# EAGLE design start_board (EAGLE 9.6.2)
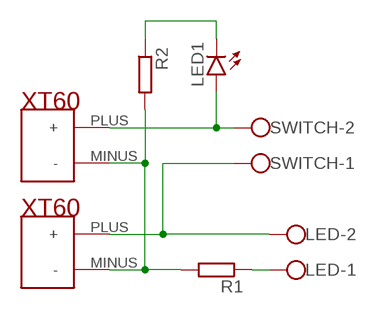
[diagram p0: schematic, sheet 1]

## Parts
LED  W237-102  [W237-102]
LED1  LEDCHIPLED_1206  [CHIPLED_1206]
R1  R-EU_M1206  [M1206]
R2  R-EU_M1206  [M1206]
SWITCH  W237-102  [W237-102]
U$1  XT60  [XT60_FOOTPRINT]
U$2  XT60  [XT60_FOOTPRINT]

## Nets
N$1: R1.2 R2.2 U$1.MINUS(-) U$2.MINUS(-)
N$2: LED1.A SWITCH.2 U$1.PLUS(+)
N$3: LED.2 SWITCH.1 U$2.PLUS(+)
N$4: LED1.C R2.1
N$5: LED.1 R1.1

## Library data of the parts
LED SWITCH = con-wago-500:W237-102: WAGO SCREW CLAMP; MPN: 237-102; OC_FARNELL: unknown; OC_NEWARK: 70K9898
LED1 = led:LED: LED OSRAM: - CHIPLED LG R971, LG N971, LY N971, LG Q971, LY Q971, LO R971, LY R971 LH N974, LH R974 LS Q976, LO Q976, LY Q976 LO Q996 - Hyper CHIPLED LW Q18S LB Q993, LB Q99A, LB R99A - SideLED LS A670, LO A670, LY A670, LG A670, LP A670 LB A673, LV A673, LT A673, LW A673 LH A674 LY A675 LS A676, LA A676, LO A676, LY A676, LW A676 LS A679, LY A679, LG A679 - Hyper Micro SIDELED® LS Y876, LA Y876, LO Y876, LY Y876 LT Y87S - SmartLED LW L88C, LW L88S LB L89C, LB L89S, LG L890 LS L89K, LO L89K, LY L89K LS L896, LA L896, LO L896, LY L896 - TOPLED LS T670, LO T670, LY T670, LG T670, LP T670 LSG T670, LSP T670, LSY T670, LOP T670, LYG T670 LG T671, LOG T671, LSG T671 LB T673, LV T673, LT T673, LW T673 LH T674 LS T676, LA T676, LO T676, LY T676, LB T676, LH T676, LSB T676, LW T676 LB T67C, LV T67C, LT T67C, LS T67K, LO T67K, LY T67K, LW E67C LS E67B, LA E67B, LO E67B, LY E67B, LB E67C, LV E67C, LT E67C LW T67C LS T679, LY T679, LG T679 LS T770, LO T770, LY T770, LG T770, LP T770 LB T773, LV T773, LT T773, LW T773 LH T774 LS E675, LA E675, LY E675, LS T675 LS T776, LA T776, LO T776, LY T776, LB T776 LHGB T686 LT T68C, LB T68C - Hyper Mini TOPLED® LB M676 - Mini TOPLED Santana® LG M470 LS M47K, LO M47K, LY M47K Source: http://www.osram.convergy.de LUXEON: - LUMILED® LXK2-PW12-R00, LXK2-PW12-S00, LXK2-PW14-U00, LXK2-PW14-V00 LXK2-PM12-R00, LXK2-PM12-S00, LXK2-PM14-U00 LXK2-PE12-Q00, LXK2-PE12-R00, LXK2-PE12-S00, LXK2-PE14-T00, LXK2-PE14-U00 LXK2-PB12-K00, LXK2-PB12-L00, LXK2-PB12-M00, LXK2-PB14-N00, LXK2-PB14-P00, LXK2-PB14-Q00 LXK2-PR12-L00, LXK2-PR12-M00, LXK2-PR14-Q00, LXK2-PR14-R00 LXK2-PD12-Q00, LXK2-PD12-R00, LXK2-PD12-S00 LXK2-PH12-R00, LXK2-PH12-S00 LXK2-PL12-P00, LXK2-PL12-Q00, LXK2-PL12-R00 Source: www.luxeon.com KINGBRIGHT: KA-3528ASYC Source: www.kingbright.com
R1 R2 = rcl:R-EU_: RESISTOR, European symbol; SPICEPREFIX: R
U$1 U$2 = XT_connectors:XT60

## Board
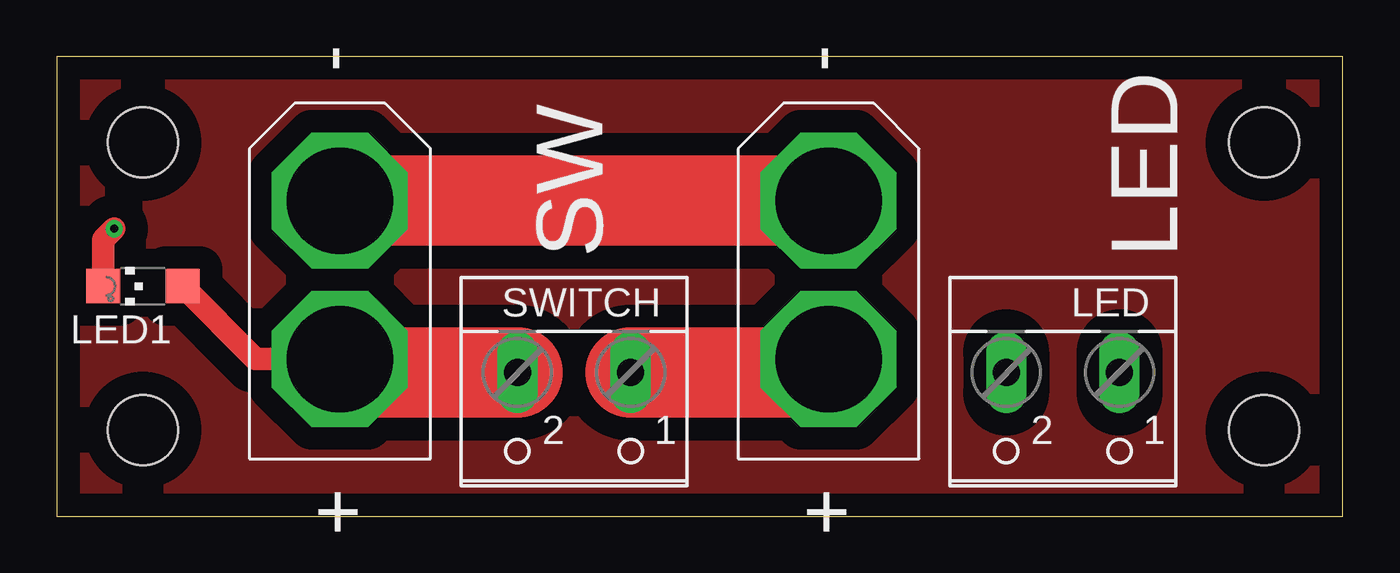
[diagram p1: board, top side]
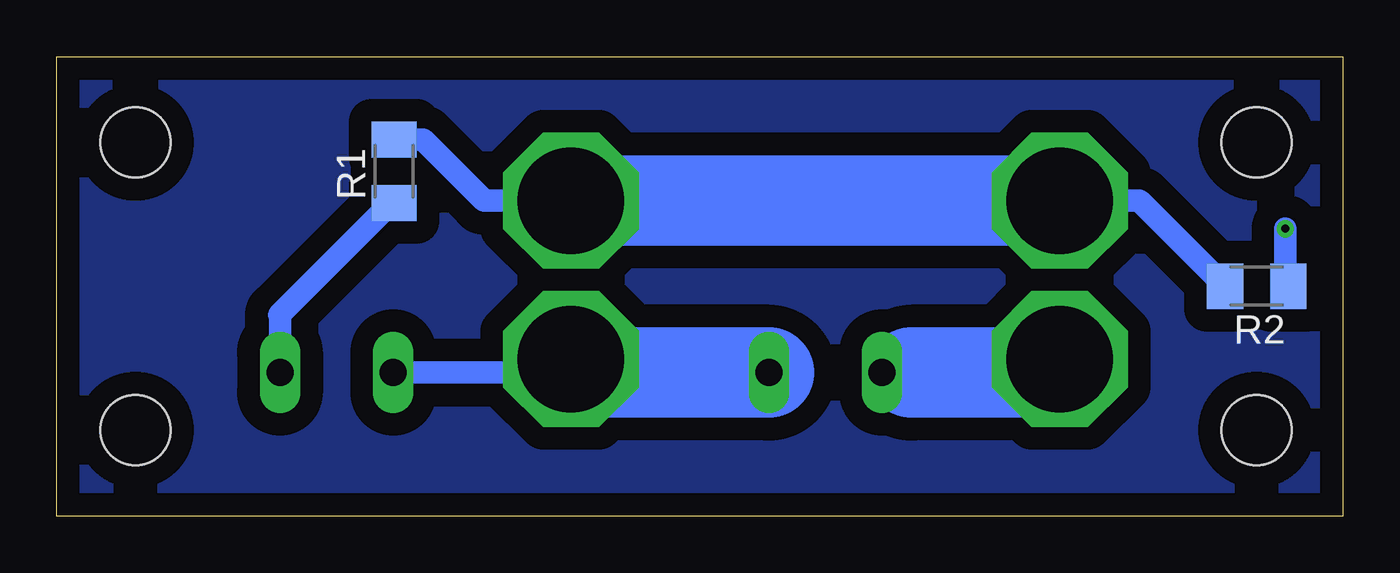
[diagram p2: board, bottom side, seen from below]

Size 56.82 x 20.31 mm. Coordinates in mm from the lower left corner, seen from the top.
Outline: 0,0 56.82,0 56.82,20.31 0,20.31 0,0
Copper layers (1*16): Top 0.035mm / dielectric 1.5mm / Bottom 0.035mm
Design rules "default": minimum track width 6mil, minimum drill 0.35mm, track to track 6mil, track to pad 6mil, pad to pad 6mil, via to via 6mil, smd to smd 6mil, copper to edge 40mil, drill to drill 6mil, minimum pad ring 10mil, minimum via ring 8mil, stop-mask expansion 4mil, vias tented up to drill 0mil, thermal gap 10mil
Holes 3.1 mm at 3.81,3.81 3.81,16.51 53.34,16.51 53.34,3.81

### Footprints (pad centres in the part's own frame; a part is rotated, then mirrored left to right if it is on the bottom)
W237-102 = drill 1.194 long: 1 -2.5,-1.27; 2 2.5,-1.27
CHIPLED_1206 = smd 1.5 x 1.5: A 0,-1.75; C 0,1.75
M1206 = smd 1.6 x 2: 1 -1.4,0; 2 1.4,0
XT60_FOOTPRINT = drill 4.7 pad 6 octagon: MINUS 11.4,4; PLUS 4.4,4

### Placement (x,y rotation side)
LED  44.45,5.08 180 top
LED1  3.81,10.16 90 top
R1  41.91,15.24 90 bottom
R2  3.81,10.16 180 bottom
SWITCH  22.86,5.08 180 top
U$1  16.51,2.54 90 top
U$2  38.1,2.54 90 top

### Tracks (layer width: path | path; a pad name or v marks a point on that pad's centre or on a via)
GND
  pour Bottom (isolate 1): 0,20.32 57.15,20.32 57.15,0 0,0
  pour Top (isolate 1): 0,20.32 57.15,20.32 57.15,0 0,0
N$1
  Top 4: U$1.MINUS 34.26,13.94 34.29,13.97
  Bottom 1: R1.2 40.64,16.64 37.94,13.94 U$2.MINUS | R2.2 8.99,13.94 U$1.MINUS
  Bottom 4: U$1.MINUS U$2.MINUS
N$2
  Top 1: U$1.PLUS 8.78,6.94 LED1.A
  Top 4: U$1.PLUS 13.1,6.35 SWITCH.2
  Bottom 4: U$1.PLUS 13.1,6.35 19.05,6.35
N$3
  Top 4: SWITCH.1 33.51,6.35 U$2.PLUS
  Bottom 1: LED.2 34.69,6.35 U$2.PLUS
  Bottom 4: SWITCH.1 33.02,6.35
N$4  (via drill 0.35)
  Top 1: LED1.C 2.06,12.22 v2.54,12.7
  Bottom 1: v2.54,12.7 2.54,10.29 R2.1
N$5
  Bottom 1: 41.95,13.8 R1.1 42.04,13.84 46.99,8.89 46.95,8.85 LED.1

### Text on the board
tNames: SW | LED